# EAGLE schematic Master (EAGLE 9.1.3)
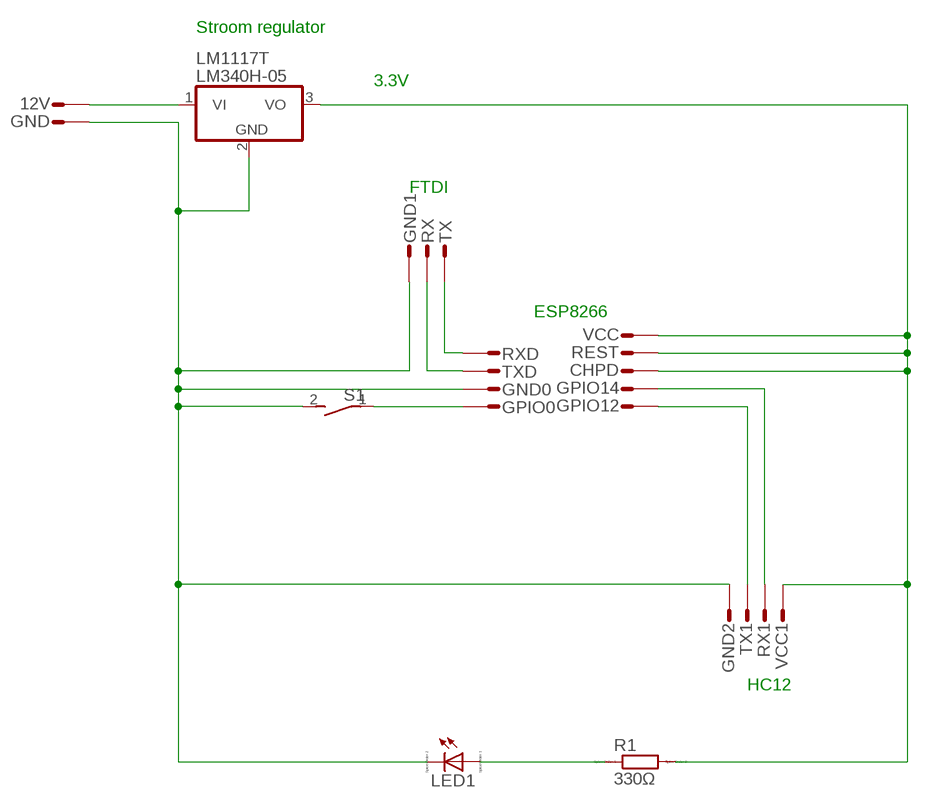
[diagram p0: schematic, sheet 1]

## Parts
12V  ST2,8  [ST2,8]
CHPD  ST2,8  [ST2,8]
GND  ST2,8  [ST2,8]
GND0  ST2,8  [ST2,8]
GND1  ST2,8  [ST2,8]
GND2  ST2,8  [ST2,8]
GPIO0  ST2,8  [ST2,8]
GPIO12  ST2,8  [ST2,8]
GPIO14  ST2,8  [ST2,8]
LED1  LED_ELD260  [LED_LD260]
LM1117T  LM340H-05  [TO220H]
R1  330Ω  R0204/7  [0204/7]
REST  ST2,8  [ST2,8]
RX  ST2,8  [ST2,8]
RX1  ST2,8  [ST2,8]
RXD  ST2,8  [ST2,8]
S1  DS01E  [DS-01]
TX  ST2,8  [ST2,8]
TX1  ST2,8  [ST2,8]
TXD  ST2,8  [ST2,8]
VCC  ST2,8  [ST2,8]
VCC1  ST2,8  [ST2,8]

## Nets
N$1: LED1.A R1.1
N$2: GPIO12.1(ST) TX1.1(ST)
N$3: GPIO14.1(ST) RX1.1(ST)
N$4: GPIO0.1(ST) S1.1
N$5: RX.1(ST) TXD.1(ST)
N$6: RXD.1(ST) TX.1(ST)
N$11: GND0.1(ST) GND1.1(ST) GND2.1(ST) GND.1(ST) LED1.K(C) LM1117T.2(GND) S1.2
N$14: CHPD.1(ST) LM1117T.3(VO) R1.2 REST.1(ST) VCC1.1(ST) VCC.1(ST)
N$20: 12V.1(ST) LM1117T.1(VI)

## Notes on the sheet
- Stroom regulator
- 3.3V
- FTDI
- ESP8266
- HC12

## Library data of the parts
12V CHPD GND GND0 GND1 GND2 GPIO0 GPIO12 GPIO14 REST RX RX1 RXD TX TX1 TXD VCC VCC1 = con-rib:ST2,8: RIBBON CABLE CONNECTOR Flachstecker / Faston; OC_FARNELL: unknown; OC_NEWARK: unknown
LED1 = eagle-ltspice:LED_E: LED Source: http://www.osram.convergy.de Source: www.luxeon.com Source: www.kingbright.com; SPICEMODEL: NONE; SPICEPREFIX: D; SPICETYPE: diode
LM1117T = linear:LM340?-*: Positive VOLTAGE REGULATOR Source: http://cache.national.com/ds/LM/LM340.pdf
R1 = eagle-ltspice:R: RESISTOR, European symbol; SPICEMODEL: NONE; SPICEPREFIX: R
S1 = switch-dil:DS01E: DIL/CODE SWITCH; OC_FARNELL: unknown; OC_NEWARK: unknown